# EAGLE design led_strip (EAGLE 8.4.2)
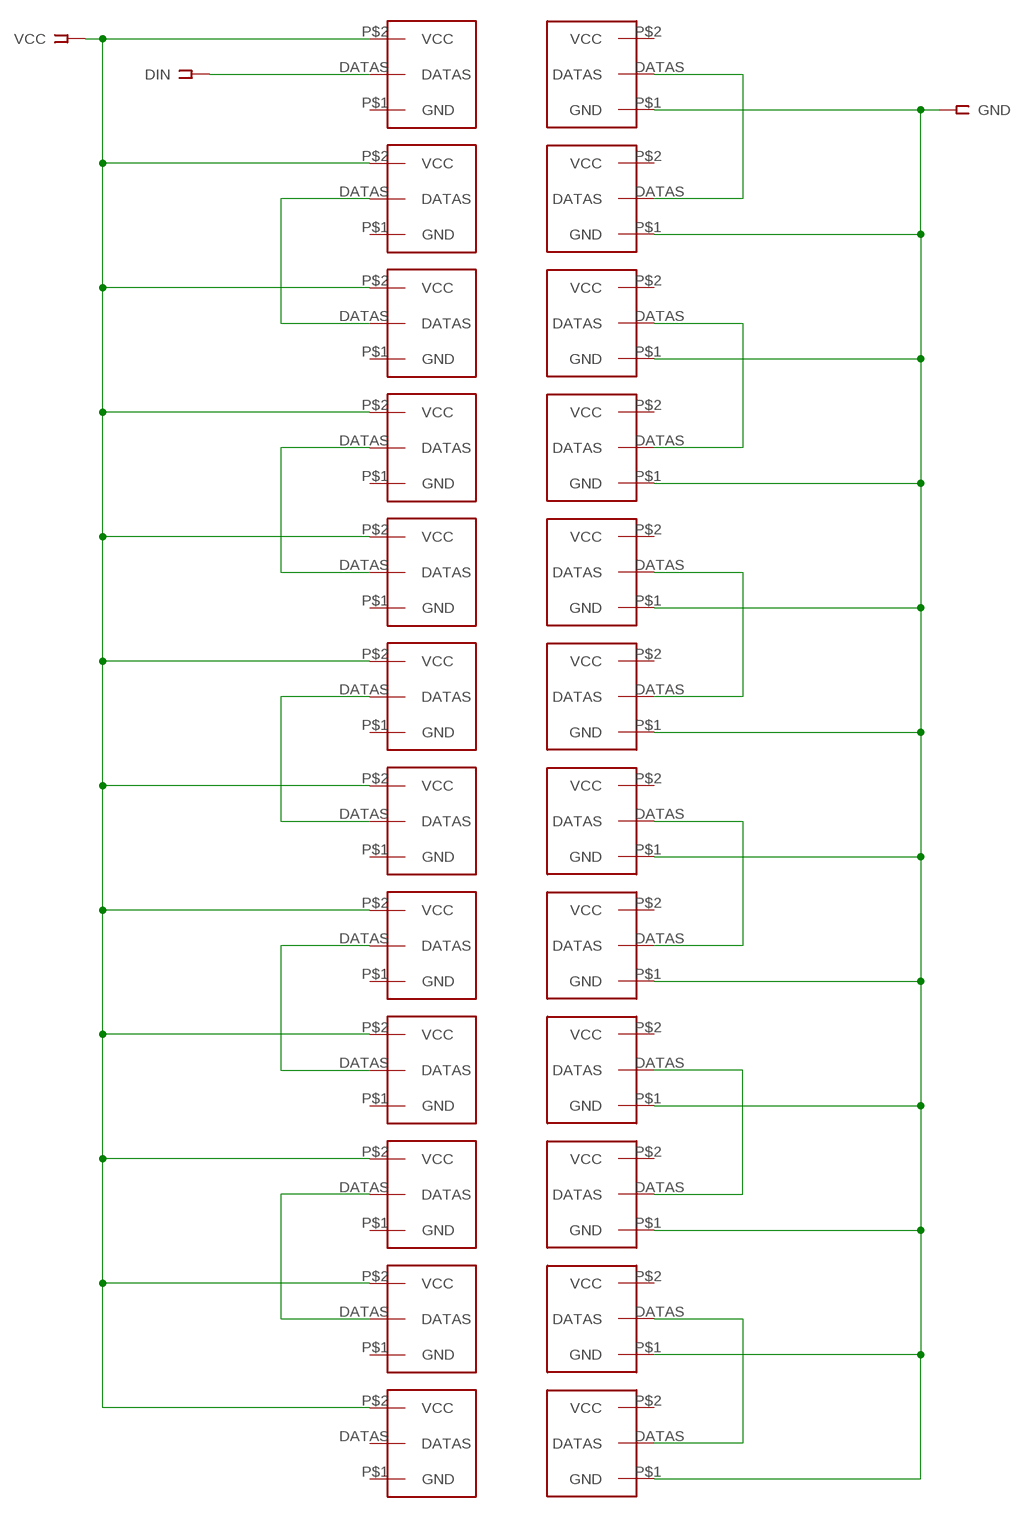
[diagram p0: schematic, sheet 1]

## Parts
1  1  LED_STRIP  [LED_STRIP]
2  LED_STRIP  [LED_STRIP]
3  LED_STRIP  [LED_STRIP]
4  LED_STRIP  [LED_STRIP]
5  LED_STRIP  [LED_STRIP]
6  LED_STRIP  [LED_STRIP]
7  LED_STRIP  [LED_STRIP]
8  LED_STRIP  [LED_STRIP]
9  LED_STRIP  [LED_STRIP]
10  LED_STRIP  [LED_STRIP]
11  LED_STRIP  [LED_STRIP]
12  LED_STRIP  [LED_STRIP]
13  LED_STRIP  [LED_STRIP]
14  LED_STRIP  [LED_STRIP]
15  LED_STRIP  [LED_STRIP]
16  LED_STRIP  [LED_STRIP]
17  LED_STRIP  [LED_STRIP]
18  LED_STRIP  [LED_STRIP]
19  LED_STRIP  [LED_STRIP]
20  LED_STRIP  [LED_STRIP]
21  LED_STRIP  [LED_STRIP]
22  LED_STRIP  [LED_STRIP]
23  LED_STRIP  [LED_STRIP]
24  LED_STRIP  [LED_STRIP]
DIN  DATA  SSW-101-02-S-S  [SSW-101-02-S-S]
GND  GND  SSW-101-02-S-S  [SSW-101-02-S-S]
VCC  VCC  SSW-101-02-S-S  [SSW-101-02-S-S]

## Nets
GND: 1.P$1(GND) 2.P$1(GND) 3.P$1(GND) 4.P$1(GND) 5.P$1(GND) 6.P$1(GND) 7.P$1(GND) 8.P$1(GND) 9.P$1(GND) 10.P$1(GND) 11.P$1(GND) 12.P$1(GND) GND.1
N$1: 13.DATAS DIN.1
N$2: 1.DATAS 2.DATAS
N$3: 14.DATAS 15.DATAS
N$4: 3.DATAS 4.DATAS
N$5: 16.DATAS 17.DATAS
N$6: 5.DATAS 6.DATAS
N$7: 18.DATAS 19.DATAS
N$8: 7.DATAS 8.DATAS
N$9: 20.DATAS 21.DATAS
N$10: 22.DATAS 23.DATAS
N$11: 9.DATAS 10.DATAS
N$12: 11.DATAS 12.DATAS
VCC: 13.P$2(VCC) 14.P$2(VCC) 15.P$2(VCC) 16.P$2(VCC) 17.P$2(VCC) 18.P$2(VCC) 19.P$2(VCC) 20.P$2(VCC) 21.P$2(VCC) 22.P$2(VCC) 23.P$2(VCC) 24.P$2(VCC) VCC.1
Unconnected: 1.P$2(VCC) 2.P$2(VCC) 3.P$2(VCC) 4.P$2(VCC) 5.P$2(VCC) 6.P$2(VCC) 7.P$2(VCC) 8.P$2(VCC) 9.P$2(VCC) 10.P$2(VCC) 11.P$2(VCC) 12.P$2(VCC) 13.P$1(GND) 14.P$1(GND) 15.P$1(GND) 16.P$1(GND) 17.P$1(GND) 18.P$1(GND) 19.P$1(GND) 20.P$1(GND) 21.P$1(GND) 22.P$1(GND) 23.P$1(GND) 24.DATAS 24.P$1(GND)

## Library data of the parts
1-24 = led_strip:LED_STRIP
DIN GND VCC = con-samtec:SSW-101-02-S-S: THROUGH-HOLE .025" SQ POST SOCKET Source: Samtec SSW.pdf; MPN: SSW-101-02-S-S; OC_FARNELL: unknown; OC_NEWARK: 11P9336

## Board
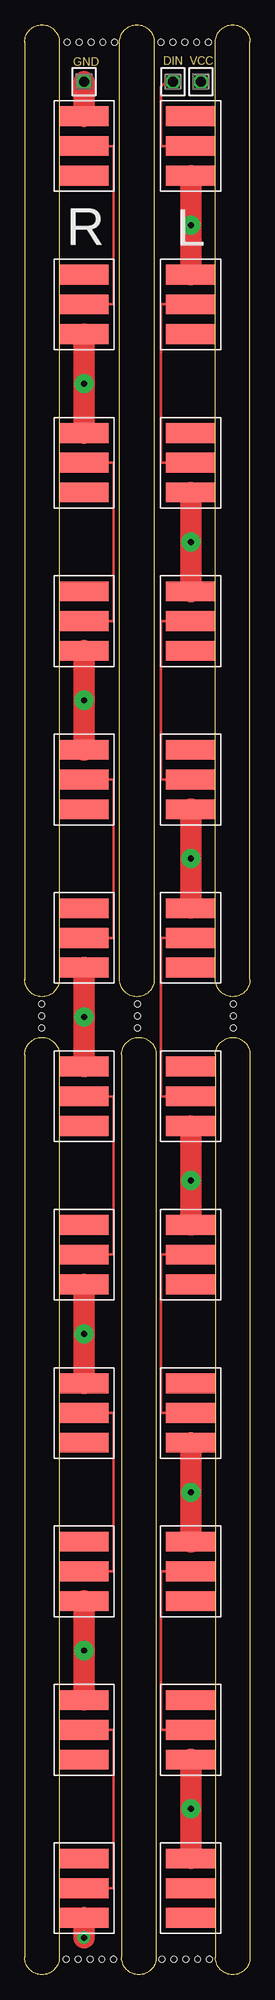
[diagram p1: board, top side]
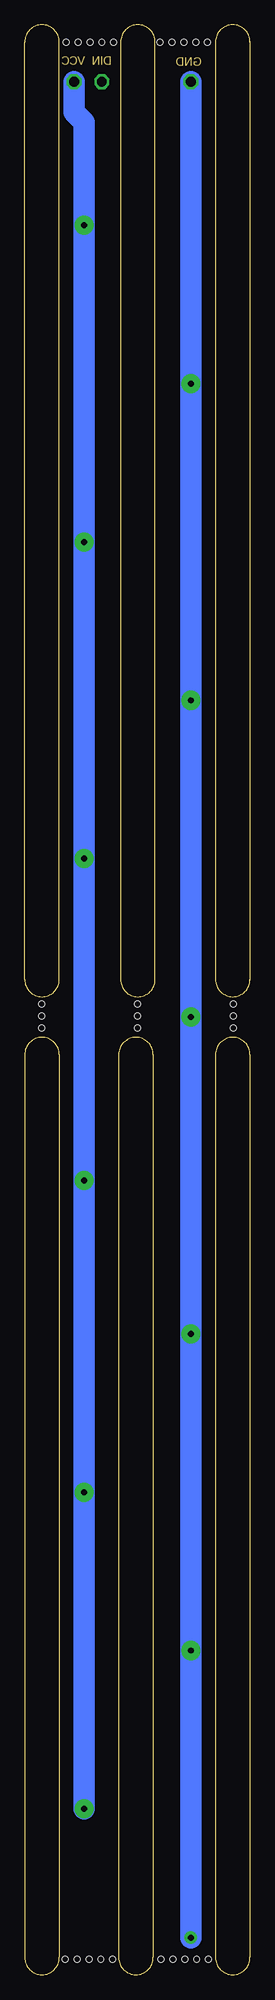
[diagram p2: board, bottom side, seen from below]

Size 22.8 x 197 mm. Coordinates in mm from the lower left corner, seen from the top.
Outline: 0,195.25 arc-180 3.5,195.25 3.5,100.55 arc-180 0,100.55
Outline: 0,195.35 0,100.45
Outline: 9.6,100.55 9.6,195.25 arc-180 13.1,195.25 13.1,100.55 arc-180 9.6,100.55
Outline: 3.5,92.95 3.5,1.75 arc-180 0,1.75 0,92.95 arc-180 3.5,92.95
Outline: 19.3,100.55 19.3,195.25 arc-180 22.8,195.25 22.8,100.55 arc-180 19.3,100.55
Outline: 9.8,92.95 arc-180 13.3,92.95 13.3,1.75 arc-180 9.8,1.75 9.8,92.95
Outline: 19.3,92.95 arc-180 22.8,92.95 22.8,1.75 arc-180 19.3,1.75 19.3,92.95
Copper layers (1*16): Top 0.035mm / dielectric 1.5mm / Bottom 0.035mm
Design rules "default": minimum track width 10mil, minimum drill 24mil, track to track 8mil, track to pad 8mil, pad to pad 8mil, via to via 8mil, smd to smd 8mil, copper to edge 40mil, drill to drill 8mil, minimum pad ring 10mil, minimum via ring 8mil, stop-mask expansion 4mil, vias tented up to drill 0mil, thermal gap 10mil
Holes 0.6 mm at 4.3,195.25 5.5,195.25 6.7,195.25 7.9,195.25 13.8,195.25 15,195.25 16.2,195.25 17.4,195.25 9.1,195.25 18.6,195.25 4.2,1.55 5.4,1.55 6.6,1.55 7.8,1.55 9,1.55 13.9,1.55 15.1,1.55 16.3,1.55 17.5,1.55 18.7,1.55 1.7,95.65 1.7,96.85 1.7,98.05 11.4,95.65 11.4,96.85 11.4,98.05 21.1,95.65 21.1,96.85 21.1,98.05

### Footprints (pad centres in the part's own frame; a part is rotated, then mirrored left to right if it is on the bottom)
LED_STRIP = smd 5 x 2: DATAS 0,0; P$1 0,3; P$2 0,-3
SSW-101-02-S-S = drill 1 pad 1.5 octagon: 1 0,0

### Placement (x,y rotation side)
1  6,184.75 0 top
2  6,168.75 180 top
3  6,152.75 0 top
4  6,136.75 180 top
5  6,120.75 0 top
6  6,104.75 180 top
7  6,88.75 0 top
8  6,72.75 180 top
9  6,56.75 0 top
10  6,40.75 180 top
11  6,24.75 0 top
12  6,8.75 180 top
13  16.8,184.75 0 top
14  16.8,168.75 180 top
15  16.8,152.75 0 top
16  16.8,136.75 180 top
17  16.8,120.75 0 top
18  16.8,104.75 180 top
19  16.8,88.75 0 top
20  16.8,72.75 180 top
21  16.8,56.75 0 top
22  16.8,40.75 180 top
23  16.8,24.75 0 top
24  16.8,8.75 180 top
DIN  15,191.25 270 top
GND  6,191.25 90 top
VCC  17.82,191.25 90 top

### Tracks (layer width: path | path; a pad name or v marks a point on that pad's centre or on a via)
GND  (via drill 0.6 pad 1.27, 0.6 pad 1.93)
  Top 2.184: 2.P$1 v6,160.75 3.P$1 | 4.P$1 v6,128.75 5.P$1 | 6.P$1 v6,96.75 7.P$1 | 8.P$1 v6,64.75 9.P$1 | 10.P$1 v6,32.75 11.P$1 | GND.1 1.P$1 | v6,3.75 12.P$1
  Bottom 2.184: v6,3.75 v6,32.75 v6,64.75 v6,96.75 v6,128.75 v6,160.75 GND.1
N$1
  Top 0.254: 13.DATAS 13.8,184.75 13.8,190.75 14.3,191.25 DIN.1
N$2
  Top 0.254: 1.DATAS 9,184.75 9,168.75 2.DATAS
N$3
  Top 0.254: 15.DATAS 13.8,152.75 13.8,168.75 14.DATAS
N$4
  Top 0.254: 3.DATAS 9,152.75 9,136.75 4.DATAS
N$5
  Top 0.254: 16.DATAS 13.8,136.75 13.8,120.75 17.DATAS
N$6
  Top 0.254: 5.DATAS 9,120.75 9,104.75 6.DATAS
N$7
  Top 0.254: 19.DATAS 13.8,88.75 13.8,104.75 18.DATAS
N$8
  Top 0.254: 7.DATAS 9,88.75 9,72.75 8.DATAS
N$9
  Top 0.254: 21.DATAS 13.8,56.75 13.8,72.75 20.DATAS
N$10
  Top 0.254: 23.DATAS 13.8,24.75 13.8,40.75 22.DATAS
N$11
  Top 0.254: 9.DATAS 9,56.75 9,40.75 10.DATAS
N$12
  Top 0.254: 11.DATAS 9,24.75 9,8.75 12.DATAS
VCC  (via drill 0.6 pad 1.93)
  Top 2.184: 13.P$2 v16.8,176.75 14.P$2 | 15.P$2 v16.8,144.75 16.P$2 | 17.P$2 v16.8,112.75 18.P$2 | 19.P$2 v16.8,80.25 20.P$2 | 21.P$2 v16.8,48.75 22.P$2 | 23.P$2 v16.8,16.75 24.P$2
  Bottom 2.184: v16.8,16.75 v16.8,48.75 v16.8,80.25 v16.8,112.75 v16.8,144.75 v16.8,176.75 16.8,187.15 17.8,188.15 17.8,191.23 VCC.1

### Text on the board
Dimension: GND | DIN | VCC
tPlace: R | L